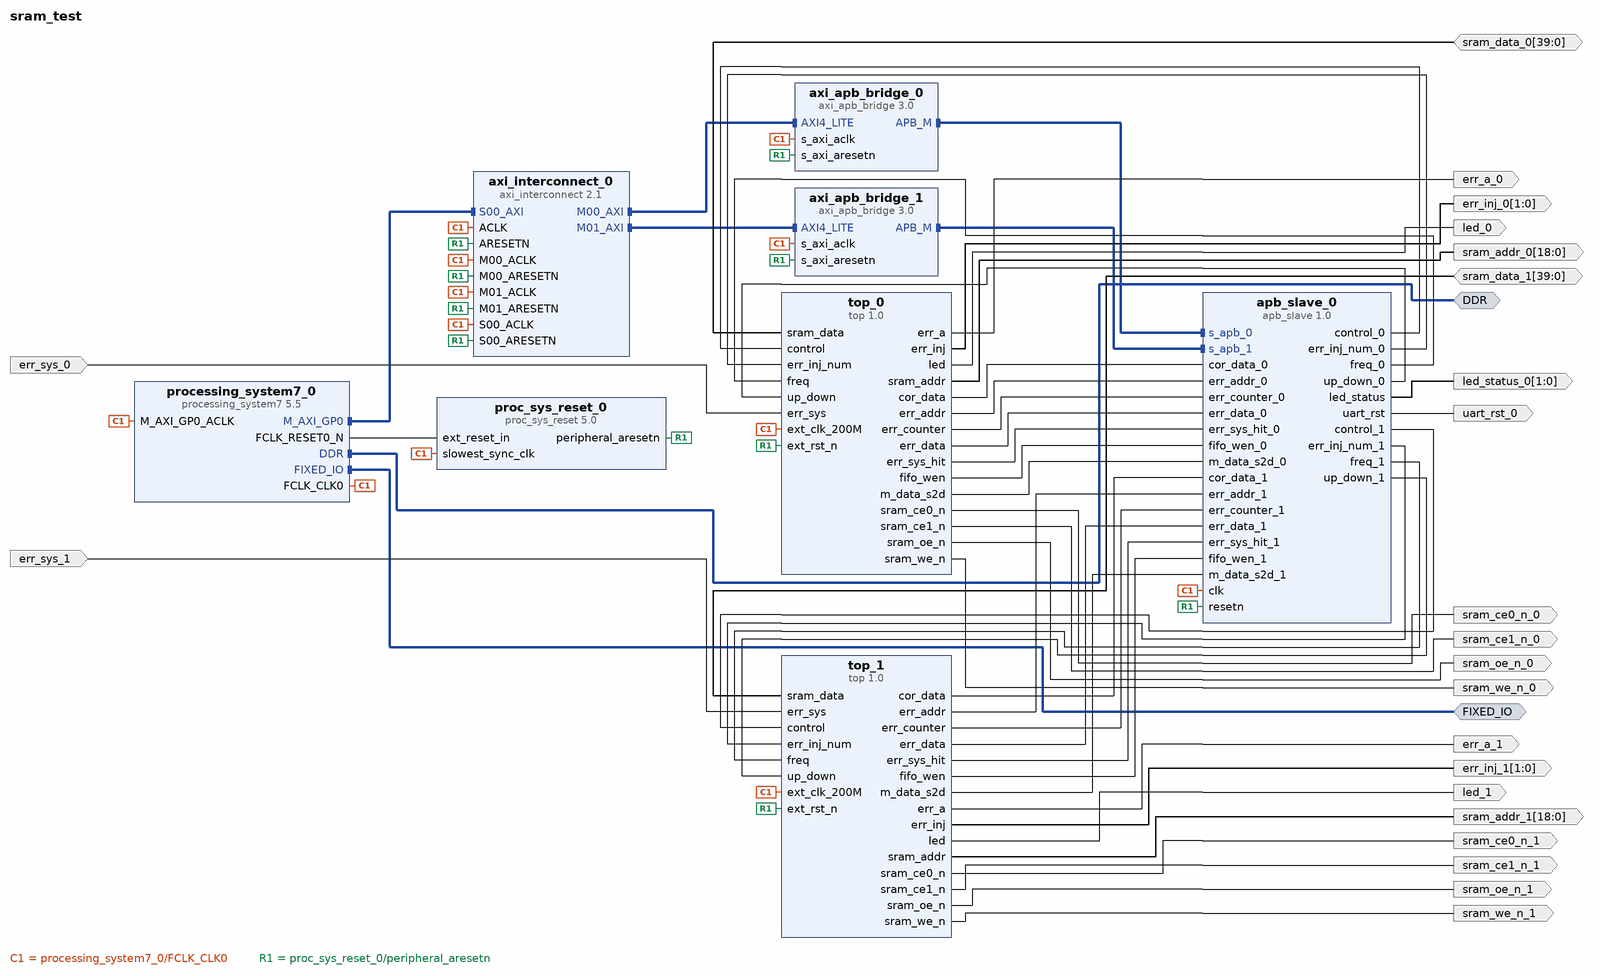
[diagram p0: block diagram of the top level]
# Vivado block design sram_test, xc7z020clg484-2, Vivado 2023.1
create_bd_design sram_test

create_bd_intf_port -mode Master -vlnv xilinx.com:interface:ddrx_rtl:1.0 DDR
create_bd_intf_port -mode Master -vlnv xilinx.com:display_processing_system7:fixedio_rtl:1.0 FIXED_IO
create_bd_port -dir O -from 1 -to 0 err_inj_0
create_bd_port -dir IO -from 39 -to 0 sram_data_0
create_bd_port -dir O -from 18 -to 0 sram_addr_0
create_bd_port -dir O sram_oe_n_0
create_bd_port -dir O sram_we_n_0
create_bd_port -dir O sram_ce1_n_0
create_bd_port -dir O sram_ce0_n_0
create_bd_port -dir O err_a_0
create_bd_port -dir IO -from 39 -to 0 sram_data_1
create_bd_port -dir O -from 18 -to 0 sram_addr_1
create_bd_port -dir O sram_oe_n_1
create_bd_port -dir O sram_we_n_1
create_bd_port -dir O sram_ce1_n_1
create_bd_port -dir O sram_ce0_n_1
create_bd_port -dir O -from 1 -to 0 err_inj_1
create_bd_port -dir O err_a_1
create_bd_port -dir I err_sys_0
create_bd_port -dir I err_sys_1
create_bd_port -dir O -type rst uart_rst_0
create_bd_port -dir O led_0
create_bd_port -dir O led_1
create_bd_port -dir O -from 1 -to 0 led_status_0

create_bd_cell -type ip -vlnv xilinx.com:ip:processing_system7:5.5 processing_system7_0
set_property -dict [list \
  CONFIG.PCW_CRYSTAL_PERIPHERAL_FREQMHZ 50 \
  CONFIG.PCW_ENET0_ENET0_IO {MIO 16 .. 27} \
  CONFIG.PCW_ENET0_GRP_MDIO_ENABLE 1 \
  CONFIG.PCW_ENET0_GRP_MDIO_IO {MIO 52 .. 53} \
  CONFIG.PCW_ENET0_PERIPHERAL_ENABLE 1 \
  CONFIG.PCW_ENET0_RESET_ENABLE 1 \
  CONFIG.PCW_ENET0_RESET_IO {MIO 7} \
  CONFIG.PCW_ENET_RESET_ENABLE 1 \
  CONFIG.PCW_ENET_RESET_SELECT {Share reset pin} \
  CONFIG.PCW_FPGA0_PERIPHERAL_FREQMHZ 200 \
  CONFIG.PCW_GPIO_MIO_GPIO_ENABLE 1 \
  CONFIG.PCW_GPIO_MIO_GPIO_IO MIO \
  CONFIG.PCW_I2C1_I2C1_IO {MIO 12 .. 13} \
  CONFIG.PCW_I2C1_PERIPHERAL_ENABLE 1 \
  CONFIG.PCW_I2C_PERIPHERAL_FREQMHZ 112.500000 \
  CONFIG.PCW_I2C_RESET_ENABLE 1 \
  CONFIG.PCW_I2C_RESET_SELECT {Share reset pin} \
  CONFIG.PCW_PRESET_BANK1_VOLTAGE {LVCMOS 1.8V} \
  CONFIG.PCW_QSPI_GRP_SINGLE_SS_ENABLE 1 \
  CONFIG.PCW_QSPI_GRP_SINGLE_SS_IO {MIO 1 .. 6} \
  CONFIG.PCW_QSPI_PERIPHERAL_ENABLE 1 \
  CONFIG.PCW_QSPI_QSPI_IO {MIO 1 .. 6} \
  CONFIG.PCW_SINGLE_QSPI_DATA_MODE x4 \
  CONFIG.PCW_UART1_BAUD_RATE 57600 \
  CONFIG.PCW_UART1_PERIPHERAL_ENABLE 1 \
  CONFIG.PCW_UART1_UART1_IO {MIO 8 .. 9} \
  CONFIG.PCW_UART_PERIPHERAL_FREQMHZ 100 \
  CONFIG.PCW_UIPARAM_DDR_PARTNO {MT41K256M16 RE-125} \
  CONFIG.PCW_USB_RESET_ENABLE 1 \
] [get_bd_cells processing_system7_0]
# 212 more settings of processing_system7_0 are not shown: defaults, MIO pin electricals, DDR timing, and values the tool derives
create_bd_cell -type ip -vlnv xilinx.com:ip:axi_interconnect:2.1 axi_interconnect_0
create_bd_cell -type ip -vlnv xilinx.com:ip:proc_sys_reset:5.0 proc_sys_reset_0
create_bd_cell -type ip -vlnv xilinx.com:ip:axi_apb_bridge:3.0 axi_apb_bridge_0
set_property -dict {CONFIG.C_APB_NUM_SLAVES 1} [get_bd_cells axi_apb_bridge_0]
create_bd_cell -type ip -vlnv xilinx.com:ip:axi_apb_bridge:3.0 axi_apb_bridge_1
set_property -dict {CONFIG.C_APB_NUM_SLAVES 1} [get_bd_cells axi_apb_bridge_1]
create_bd_cell -type ip -vlnv xilinx.com:user:apb_slave:1.0 apb_slave_0
create_bd_cell -type ip -vlnv xilinx.com:user:top:1.0 top_0
create_bd_cell -type ip -vlnv xilinx.com:user:top:1.0 top_1

# ---- connections ----

connect_bd_intf_net [get_bd_intf_pins axi_interconnect_0/S00_AXI] [get_bd_intf_pins processing_system7_0/M_AXI_GP0]
connect_bd_intf_net [get_bd_intf_pins axi_apb_bridge_0/APB_M] [get_bd_intf_pins apb_slave_0/s_apb_0]
connect_bd_intf_net [get_bd_intf_pins axi_apb_bridge_1/APB_M] [get_bd_intf_pins apb_slave_0/s_apb_1]
connect_bd_intf_net [get_bd_intf_pins axi_interconnect_0/M00_AXI] [get_bd_intf_pins axi_apb_bridge_0/AXI4_LITE]
connect_bd_intf_net [get_bd_intf_pins axi_interconnect_0/M01_AXI] [get_bd_intf_pins axi_apb_bridge_1/AXI4_LITE]
connect_bd_intf_net [get_bd_intf_ports DDR] [get_bd_intf_pins processing_system7_0/DDR]
connect_bd_intf_net [get_bd_intf_ports FIXED_IO] [get_bd_intf_pins processing_system7_0/FIXED_IO]
connect_bd_net [get_bd_ports sram_data_0] [get_bd_pins top_0/sram_data]
connect_bd_net [get_bd_ports sram_data_1] [get_bd_pins top_1/sram_data]
connect_bd_net [get_bd_pins apb_slave_0/control_0] [get_bd_pins top_0/control]
connect_bd_net [get_bd_pins apb_slave_0/control_1] [get_bd_pins top_1/control]
connect_bd_net [get_bd_pins apb_slave_0/err_inj_num_0] [get_bd_pins top_0/err_inj_num]
connect_bd_net [get_bd_pins apb_slave_0/err_inj_num_1] [get_bd_pins top_1/err_inj_num]
connect_bd_net [get_bd_pins apb_slave_0/freq_0] [get_bd_pins top_0/freq]
connect_bd_net [get_bd_pins apb_slave_0/freq_1] [get_bd_pins top_1/freq]
connect_bd_net [get_bd_pins apb_slave_0/led_status] [get_bd_ports led_status_0]
connect_bd_net [get_bd_pins apb_slave_0/uart_rst] [get_bd_ports uart_rst_0]
connect_bd_net [get_bd_pins apb_slave_0/up_down_0] [get_bd_pins top_0/up_down]
connect_bd_net [get_bd_pins apb_slave_0/up_down_1] [get_bd_pins top_1/up_down]
connect_bd_net -net clk_wizard_0_clk_out [get_bd_pins processing_system7_0/FCLK_CLK0] \
  [get_bd_pins proc_sys_reset_0/slowest_sync_clk] [get_bd_pins processing_system7_0/M_AXI_GP0_ACLK] \
  [get_bd_pins axi_apb_bridge_0/s_axi_aclk] [get_bd_pins axi_apb_bridge_1/s_axi_aclk] [get_bd_pins axi_interconnect_0/ACLK] \
  [get_bd_pins axi_interconnect_0/M01_ACLK] [get_bd_pins axi_interconnect_0/M00_ACLK] \
  [get_bd_pins axi_interconnect_0/S00_ACLK] [get_bd_pins apb_slave_0/clk] [get_bd_pins top_0/ext_clk_200M] \
  [get_bd_pins top_1/ext_clk_200M]
connect_bd_net -net err_sys_0_1 [get_bd_ports err_sys_0] [get_bd_pins top_0/err_sys]
connect_bd_net -net err_sys_1_1 [get_bd_ports err_sys_1] [get_bd_pins top_1/err_sys]
connect_bd_net [get_bd_pins proc_sys_reset_0/peripheral_aresetn] \
  [get_bd_pins axi_apb_bridge_0/s_axi_aresetn] [get_bd_pins axi_interconnect_0/ARESETN] \
  [get_bd_pins axi_interconnect_0/M00_ARESETN] [get_bd_pins axi_interconnect_0/M01_ARESETN] \
  [get_bd_pins axi_interconnect_0/S00_ARESETN] [get_bd_pins axi_apb_bridge_1/s_axi_aresetn] [get_bd_pins apb_slave_0/resetn] \
  [get_bd_pins top_0/ext_rst_n] [get_bd_pins top_1/ext_rst_n]
connect_bd_net [get_bd_pins processing_system7_0/FCLK_RESET0_N] [get_bd_pins proc_sys_reset_0/ext_reset_in]
connect_bd_net [get_bd_pins top_0/cor_data] [get_bd_pins apb_slave_0/cor_data_0]
connect_bd_net [get_bd_pins top_0/err_a] [get_bd_ports err_a_0]
connect_bd_net [get_bd_pins top_0/err_addr] [get_bd_pins apb_slave_0/err_addr_0]
connect_bd_net [get_bd_pins top_0/err_counter] [get_bd_pins apb_slave_0/err_counter_0]
connect_bd_net [get_bd_pins top_0/err_data] [get_bd_pins apb_slave_0/err_data_0]
connect_bd_net [get_bd_pins top_0/err_inj] [get_bd_ports err_inj_0]
connect_bd_net [get_bd_pins top_0/err_sys_hit] [get_bd_pins apb_slave_0/err_sys_hit_0]
connect_bd_net [get_bd_pins top_0/fifo_wen] [get_bd_pins apb_slave_0/fifo_wen_0]
connect_bd_net [get_bd_pins top_0/led] [get_bd_ports led_0]
connect_bd_net [get_bd_pins top_0/m_data_s2d] [get_bd_pins apb_slave_0/m_data_s2d_0]
connect_bd_net [get_bd_pins top_0/sram_addr] [get_bd_ports sram_addr_0]
connect_bd_net [get_bd_pins top_0/sram_ce0_n] [get_bd_ports sram_ce0_n_0]
connect_bd_net [get_bd_pins top_0/sram_ce1_n] [get_bd_ports sram_ce1_n_0]
connect_bd_net [get_bd_pins top_0/sram_oe_n] [get_bd_ports sram_oe_n_0]
connect_bd_net [get_bd_pins top_0/sram_we_n] [get_bd_ports sram_we_n_0]
connect_bd_net [get_bd_pins top_1/cor_data] [get_bd_pins apb_slave_0/cor_data_1]
connect_bd_net [get_bd_pins top_1/err_a] [get_bd_ports err_a_1]
connect_bd_net [get_bd_pins top_1/err_addr] [get_bd_pins apb_slave_0/err_addr_1]
connect_bd_net [get_bd_pins top_1/err_counter] [get_bd_pins apb_slave_0/err_counter_1]
connect_bd_net [get_bd_pins top_1/err_data] [get_bd_pins apb_slave_0/err_data_1]
connect_bd_net [get_bd_pins top_1/err_inj] [get_bd_ports err_inj_1]
connect_bd_net [get_bd_pins top_1/err_sys_hit] [get_bd_pins apb_slave_0/err_sys_hit_1]
connect_bd_net [get_bd_pins top_1/fifo_wen] [get_bd_pins apb_slave_0/fifo_wen_1]
connect_bd_net [get_bd_pins top_1/led] [get_bd_ports led_1]
connect_bd_net [get_bd_pins top_1/m_data_s2d] [get_bd_pins apb_slave_0/m_data_s2d_1]
connect_bd_net [get_bd_pins top_1/sram_addr] [get_bd_ports sram_addr_1]
connect_bd_net [get_bd_pins top_1/sram_ce0_n] [get_bd_ports sram_ce0_n_1]
connect_bd_net [get_bd_pins top_1/sram_ce1_n] [get_bd_ports sram_ce1_n_1]
connect_bd_net [get_bd_pins top_1/sram_oe_n] [get_bd_ports sram_oe_n_1]
connect_bd_net [get_bd_pins top_1/sram_we_n] [get_bd_ports sram_we_n_1]

# ---- address map ----
assign_bd_address -offset 0x43C00000 -range 64K -target_address_space [get_bd_addr_spaces processing_system7_0/Data] [get_bd_addr_segs apb_slave_0/s_apb_0/Reg]
assign_bd_address -offset 0x43C10000 -range 64K -target_address_space [get_bd_addr_spaces processing_system7_0/Data] [get_bd_addr_segs apb_slave_0/s_apb_1/s_apb]

validate_bd_design
save_bd_design
